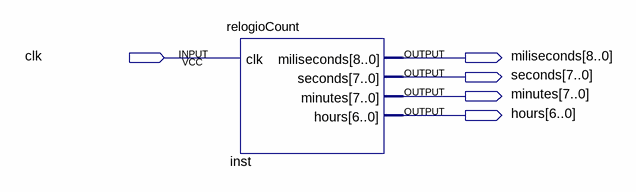
[diagram p0: schematic sheet]
// Quartus schematic relogio.bdf as structural Verilog: 1 symbols, 5 pins
module relogio (
  input  clk,
  output [8:0] miliseconds,
  output [7:0] seconds,
  output [7:0] minutes,
  output [6:0] hours
);

  relogioCount inst (.clk(clk), .miliseconds(miliseconds), .seconds(seconds), .minutes(minutes), .hours(hours));
endmodule
